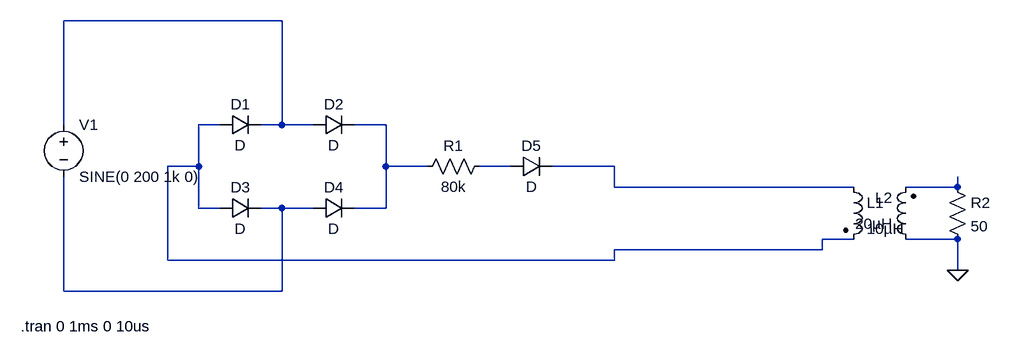
[diagram p0: schematic hv_sync_sim_v2.asc]
hv_sync_sim_v2.asc, the LTspice schematic file:
Version 4
SHEET 1 1416 680
WIRE 320 -128 -16 -128
WIRE -16 32 -16 -128
WIRE 224 32 192 32
WIRE 320 32 320 -128
WIRE 320 32 288 32
WIRE 368 32 320 32
WIRE 480 32 432 32
WIRE 192 96 192 32
WIRE 192 96 144 96
WIRE 480 96 480 32
WIRE 544 96 480 96
WIRE 672 96 624 96
WIRE 832 96 736 96
WIRE 832 128 832 96
WIRE 1200 128 832 128
WIRE 1360 128 1360 112
WIRE 1360 128 1280 128
WIRE 192 160 192 96
WIRE 224 160 192 160
WIRE 320 160 288 160
WIRE 368 160 320 160
WIRE 480 160 480 96
WIRE 480 160 432 160
WIRE 1200 208 1152 208
WIRE 1360 208 1280 208
WIRE 1152 224 1152 208
WIRE 1152 224 832 224
WIRE 144 240 144 96
WIRE 832 240 832 224
WIRE 832 240 144 240
WIRE 1360 256 1360 208
WIRE -16 288 -16 112
WIRE 320 288 320 160
WIRE 320 288 -16 288
FLAG 1360 256 0
SYMBOL voltage -16 16 R0
WINDOW 123 0 0 Left 2
WINDOW 39 0 0 Left 2
SYMATTR InstName V1
SYMATTR Value SINE(0 200 1k 0)
SYMBOL diode 224 48 R270
WINDOW 0 32 32 VTop 2
WINDOW 3 0 32 VBottom 2
SYMATTR InstName D1
SYMBOL diode 368 48 R270
WINDOW 0 32 32 VTop 2
WINDOW 3 0 32 VBottom 2
SYMATTR InstName D2
SYMBOL diode 224 176 R270
WINDOW 0 32 32 VTop 2
WINDOW 3 0 32 VBottom 2
SYMATTR InstName D3
SYMBOL diode 368 176 R270
WINDOW 0 32 32 VTop 2
WINDOW 3 0 32 VBottom 2
SYMATTR InstName D4
SYMBOL res 640 80 R90
WINDOW 0 0 56 VBottom 2
WINDOW 3 32 56 VTop 2
SYMATTR InstName R1
SYMATTR Value 80k
SYMBOL diode 672 112 R270
WINDOW 0 32 32 VTop 2
WINDOW 3 0 32 VBottom 2
SYMATTR InstName D5
SYMBOL ind2 1184 112 R0
SYMATTR InstName L1
SYMATTR Value 10µH
SYMBOL ind2 1296 224 R180
WINDOW 0 36 80 Left 2
WINDOW 3 36 40 Left 2
SYMATTR InstName L2
SYMATTR Value 20µH
SYMBOL res 1344 112 R0
SYMATTR InstName R2
SYMATTR Value 50
TEXT -82 342 Left 2 !.tran 0 1ms 0 10us

The netlist it stands for:
* hv_sync_sim_v2.asc
V1 N001 N007 SINE(0 200 1k 0)
D1 N002 N001 D
D2 N001 N003 D
D3 N002 N007 D
D4 N007 N003 D
R1 N004 N003 80k
D5 N004 N005 D
L1 N005 N002 10µH
L2 0 N006 20µH
R2 N006 0 50
.model D D
.lib standard.dio
.tran 0 1ms 0 10us
.backanno
.end